# EasyEDA Pro project ProPrj_nrf52833_LighthouseTag_2025-07-26.epro, board PCB18
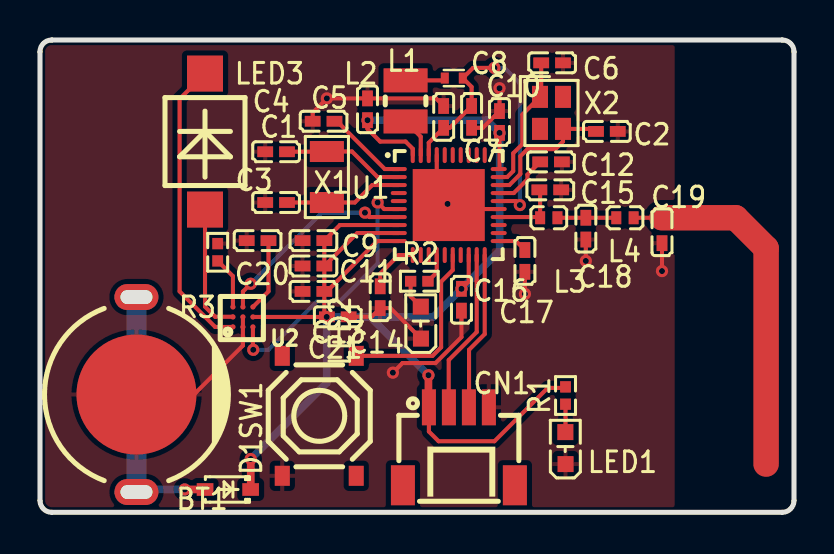
[diagram p5: board, top side]
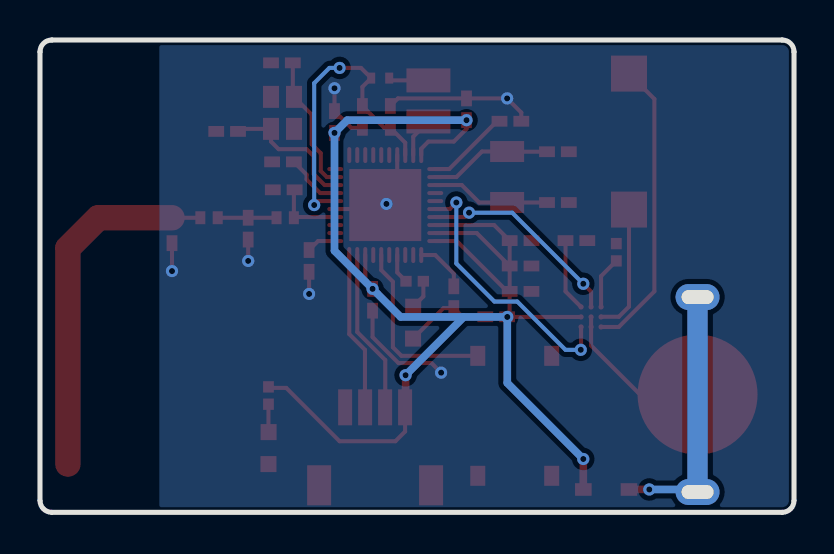
[diagram p6: board, bottom side, seen from below]

Outline 37.72 x 23.62 mm; copper layers: Top Layer, Bottom Layer. Coordinates in mm from the lower left corner of the outline.
Outline path: 0,23.03 0,0.59 arc(0.17,0.17) 0.59,0 37.13,0 arc(37.55,0.17) 37.72,0.59 37.72,23.03 arc(37.55,23.45) 37.13,23.62 0.59,23.62 arc(0.17,23.45) 0,23.03
Stack: Top Layer 0.035mm / Dielectric1 1.51mm FR4 er 4.5 / Bottom Layer 0.035mm

## Design rules (mm)
spacing safeClearance (default): track to track 0.152, other pairs 0.152 to 0.3
track width trackWidth (default): min 0.127, default 0.203, max 2.54
differential pair differentialPair (default): width min 0.127, default 0.254, max 2.54; gap min 0.152, default 0.152
via viaSize (default): diameter min 0.5, default 0.61, max 10; hole min 0.3, default 0.305, max 6

## Placement (name value [footprint] x y rotation side)
BT1  MY-927-01  [BAT-TH_MY-927-01]  4.83 5.89 270 top
C1  12pF  [C0402]  11.81 18.03 0 top
C2  12pF  [C0402]  28.36 19.05 0 top
C3  12pF  [C0402]  11.81 15.49 0 top
C4  100nF  [C0402]  14.19 19.56 180 top
C5  1uF  [C0402]  16.38 20.16 90 top
C6  12pF  [C0402]  25.62 22.48 0 top
C7  47nF  [C0402]  20.19 19.78 90 top
C8  1uF  [C0402]  21.59 19.78 270 top
C9  4.7uF  [C0402]  13.68 13.59 180 top
C10  100nF  [C0402]  22.99 19.52 90 top
C11  4.7uF  [C0402]  13.68 12.32 180 top
C12  100nF  [C0402]  25.56 17.53 0 top
C13  4.7uF  [C0402]  13.68 11.05 180 top
C14  4.7uF  [C0402]  17.02 10.76 90 top
C15  1pF  [C0402]  25.53 16.13 0 top
C16  100nF  [C0402]  21.08 10.63 90 top
C17  820pF  [C0402]  24.26 12.57 270 top
C18  1.2pF  [C0402]  27.31 14.19 90 top
C19  12pF  [C0402]  31.12 14.01 90 top
C20  1uF  [C0402]  10.88 13.59 0 top
C21  100nF  [C0402]  14.9 9.78 0 top
CN1  1.0-4PWB  [CONN-SMD_4P-P1.00_DEALON_1.0-4PWB]  20.96 3.3 0 top
D1  BZT52C3V3S  [SOD-323_L1.7-W1.3-LS2.6-RD]  9.4 1.14 180 top
L1  15nH  [IND-SMD_L1.0-W0.5-2]  20.7 21.72 0 top
L2  10uH  [IND-SMD_L2.5-W2.0]  18.29 20.57 90 top
L3  4.7nH  [IND-SMD_L1.0-W0.6]  25.45 14.73 0 top
L4  2.2nH  [IND-SMD_L1.0-W0.6]  29.26 14.73 0 top
LED1  NCD0603G1  [LED0603-RD_1]  26.29 3.21 90 top
LED2  NCD0603G1  [LED0603-RD_1]  19.05 9.49 90 top
LED3  VBPW34S  [SENSOR-SMD_L4.4-W3.9]  8.25 18.54 90 top
R1  10kΩ  [R0402]  26.29 5.84 90 top
R2  10kΩ  [R0402]  18.97 11.56 0 top
R3  15kΩ  [R0402]  8.89 13.01 270 top
SW1  TS-1187A-B-A-B  [SW-SMD_4P-L5.1-W5.1-P3.70-LS6.5-TL_H1.5]  13.97 4.83 90 top
U1  nRF52833-QDAA-R  [QFN-40_L5.0-W5.0-P0.40-TL-EP3.6]  20.45 15.37 0 top
U2  -  [TS4231]  10.16 9.78 90 top
X1  32.768kHz  [OSC-SMD_L3.2-W1.5]  14.35 16.77 90 top
X2  32MHz  [CRYSTAL-SMD_4P-L2.0-W1.6-BL-2]  25.59 19.98 270 top

## Footprints (pads in the part's own frame, mm; a bottom-side part is the same pattern mirrored in y, then rotated)
BAT-TH_MY-927-01
  oval 1.3x2.2 hole 0.7x1.6: 1(-4.875,-0.001) 1(4.875,0.001)
  round 6 smd: 2(0,0.001)
C0402
  rect 0.79x0.54 smd: 1(-0.545,0) 2(0.545,0)
CONN-SMD_4P-P1.00_DEALON_1.0-4PWB
  rect 0.7x1.8 smd: 1(-1.5,1.95) 2(-0.5,1.95) 3(0.5,1.95) 4(1.5,1.95)
  rect 1.2x2 smd: 5(2.8,-1.95) 6(-2.8,-1.95)
CRYSTAL-SMD_4P-L2.0-W1.6-BL-2
  rect 1.1x0.8 smd: 1(-0.8,-0.575) 2(0.8,-0.575) 3(0.8,0.575) 4(-0.8,0.575)
IND-SMD_L1.0-W0.5-2
  rect 0.4x0.55 smd: 1(-0.45,0) 2(0.45,0)
IND-SMD_L1.0-W0.6
  rect 0.5x0.648 smd: 1(-0.434,0) 2(0.434,0)
IND-SMD_L2.5-W2.0
  rect 1.2x2.2 smd: 1(1.028,0) 2(-1.028,0)
LED0603-RD_1
  rect 0.8x0.8 smd: 1(-0.799,-0.004) 2(0.799,0.004)
OSC-SMD_L3.2-W1.5
  rect 1.05x1.7 smd: 1(-1.275,0) 2(1.275,0)
QFN-40_L5.0-W5.0-P0.40-TL-EP3.6
  oval 0.8x0.2 smd: 1(-2.499,1.8) 2(-2.499,1.4) 3(-2.499,1) 4(-2.499,0.6) 5(-2.499,0.2) 6(-2.499,-0.2) 7(-2.499,-0.6) 8(-2.499,-1) 9(-2.499,-1.4) 10(-2.499,-1.8) 21(2.499,-1.8) 22(2.499,-1.4) 23(2.499,-1) 24(2.499,-0.6) 25(2.499,-0.2) 26(2.499,0.2) 27(2.499,0.6) 28(2.499,1) 29(2.499,1.4) 30(2.499,1.8)
  oval 0.2x0.8 smd: 11(-1.8,-2.499) 12(-1.4,-2.499) 13(-1,-2.499) 14(-0.6,-2.499) 15(-0.2,-2.499) 16(0.2,-2.499) 17(0.6,-2.499) 18(1,-2.499) 19(1.4,-2.499) 20(1.8,-2.499) 31(1.8,2.499) 32(1.4,2.499) 33(1,2.499) 34(0.6,2.499) 35(0.2,2.499) 36(-0.2,2.499) 37(-0.6,2.499) 38(-1,2.499) 39(-1.4,2.499) 40(-1.8,2.499)
  rect 3.6x3.6 smd: 41(0,0)
R0402
  rect 0.566x0.54 smd: 1(-0.433,0) 2(0.433,0)
SENSOR-SMD_L4.4-W3.9
  rect 1.8x1.8 smd: 1(-3.4,0) 2(3.4,0)
SOD-323_L1.7-W1.3-LS2.6-RD
  rect 0.83x0.63 smd: 1(-1.14,0) 2(1.14,0)
SW-SMD_4P-L5.1-W5.1-P3.70-LS6.5-TL_H1.5
  rect 1x0.75 smd: 1(-3,1.85) 2(3,1.85) 3(-3,-1.85) 4(3,-1.85)
TS4231
  round 0.262 smd: 1(-0.508,0.508) 2(-0.008,0.508) 3(0.492,0.508) 4(-0.508,0.008) 5(-0.008,0.008) 6(0.492,0.008) 7(-0.508,-0.492) 8(-0.008,-0.492) 9(0.492,-0.492)

## Nets
GND: BT1.2 C1.1 C2.2 C3.1 C4.2 C5.2 C6.2 C7.2 C8.2 C9.2 C10.2 C11.2 C12.2 C13.2 C14.1 C15.2 C16.1 C17.2 C18.1 C19.1 C20.1 C21.2 CN1.4 LED1.1 LED2.1 R3.1 SW1.1 U1.25 U1.37 U1.41 U2.4 U2.5
VDD_NRF: C5.1 C9.1 C10.1 C11.1 C13.1 C16.2 C21.1 CN1.1 D1.1 R1.2 U1.8 U1.9 U1.10 U1.18 U1.30 U1.40 U2.8
D/CFGDATA: U1.7 U2.6
DCC: L2.2 U1.39
DEC4: C7.1 C8.1 L1.2 U1.26 U1.38
E/CFGCLK: U1.6 U2.7
LED: R2.2 U1.14
RESET: SW1.4 U1.16
SWDCLK: CN1.3 U1.20
SWDIO: CN1.2 U1.19
XC1: C2.1 U1.28 X2.3
XC2: C6.1 U1.29 X2.1
XL1: C1.2 U1.2 X1.2
XL2: C3.2 U1.3 X1.1
$1N1552: C14.2 U1.11
$1N2289: C17.1 U1.21
$1N2530: C15.1 L3.1 U1.24
$1N2985: C18.2 L3.2 L4.1
$1N3242: C19.2 L4.2
$1N3495: C12.1 U1.27
$1N6091: L1.1 L2.1
$1N9430: C20.2 U2.9
$1N11204: LED3.2 U2.1
$1N11226: LED3.1 U2.2
$1N11357: R3.2 U2.3
$1N20837: BT1.1 D1.2
$1N22902: LED2.2 R2.1
$1N23087: C4.1 U1.1
$1N23686: LED1.2 R1.1

Pads without a net: CN1 5 6; SW1 2 3; U1 4 5 12 13 15 17 22 23 31 32 33 34 35 36; X2 2 4

## Via types
v1: diameter 0.61, hole 0.305, Top Layer to Bottom Layer, 20 vias

## Routing (per net, layer and track width the routed paths; a pad name or vN(x,y) marks a point on that pad's centre or on a via; arc(x,y) is an arc through that point)
GND: length 36.9
  Top Layer w0.203: C4.2 13.64,19.99 v1(14.35,20.7) C5.2 19.81,20.7 C7.2 ; U1.25 20.65,15.17 v1(20.39,15.42) 19.85,15.97 U1.37 ; LED2.1 17.53,10.21 C14.1 16.58,9.78 C21.2 ; C19.1 v1(31.12,12.06) ; C18.1 v1(27.31,12.57) ; 4.83,5.97 7.78,5.97 10.15,8.34 U2.4 U2.5 ; 24.26,12.03 v1(24.26,10.92) ; C16.1 21.08,8.76 19.79,7.47 18.14,7.47 v1(17.65,6.98) ; C8.2 22.15,19.23 C10.2 v1(22.99,21.21)
VDD_NRF: length 75.9
  Top Layer w0.203: U1.8 15,14.37 C9.1 C11.1 ; v1(22.99,18.98) 22.99,17.21 U1.30 ; U1.9 15.87,13.97 C11.1 ; C13.1 C11.1 ; C13.1 14.22,9.89 v1(14.34,9.77) ; C13.1 14.35,11.05 16.87,13.57 U1.10 ; U1.40 18.65,18.18 18.29,18.54 17.02,18.54 16.38,19.18 v1(16.38,19.61) ; U2.8 v1(14.34,9.77) ; v1(14.34,9.77) C21.1 ; v1(21.08,11.18) 21.45,11.54 U1.18 ; 26.24,6.22 25.4,6.22 22.73,3.56 19.94,3.56 19.46,4.04 19.46,5
  Top Layer w0.381: 19.46,5 19.43,5.02 v1(19.43,6.86) ; v1(10.54,2.67) 10.54,1.15 10.54,1.14
  Bottom Layer w0.381: v1(16.38,19.61) 22.35,19.61 v1(22.99,18.98) 22.99,13.08 v1(21.08,11.18) 19.68,9.77 16.52,9.77 ; v1(19.43,6.86) 16.52,9.77 ; 16.52,9.77 v1(14.34,9.77) 14.34,6.47 v1(10.54,2.67)
D/CFGDATA: length 10.3
  Top Layer w0.203: v1(10.54,11.43) 10.15,11.04 U2.6 ; U1.7 16.47,14.77 v1(16.26,14.99)
  Bottom Layer w0.203: v1(10.54,11.43) 14.1,14.99 v1(16.26,14.99)
DCC: length 2
  Top Layer w0.203: L2.2 19.05,18.79 U1.39
DEC4: length 15.7
  Top Layer w0.203: U1.26 23.8,15.57 v1(24,15.37) ; v1(22.73,22.22) 21.66,22.22 L1.2 21.59,21.28 C8.1 20.5,19.23 C7.1 19.45,18.48 U1.38
  Bottom Layer w0.203: v1(24,15.37) 24,21.46 23.24,22.22 v1(22.73,22.22)
E/CFGCLK: length 13.4
  Top Layer w0.203: v1(16.89,15.49) 17.22,15.17 U1.6 ; U2.7 10.65,8.14 v1(10.67,8.13)
  Bottom Layer w0.203: v1(16.89,15.49) 16.89,12.45 14.99,10.54 13.84,10.54 11.43,8.13 v1(10.67,8.13)
LED: length 1.5
  Top Layer w0.203: U1.14 19.85,12 R2.2
RESET: length 9.3
  Top Layer w0.203: U1.16 20.65,12.11 20.07,11.53 20.07,8.25 19.64,7.83 SW1.4
SWDCLK: length 8.1
  Top Layer w0.203: U1.20 22.25,8.91 21.46,8.13 21.46,5.05
SWDIO: length 8.4
  Top Layer w0.203: 21.85,11.56 21.84,11.56 ; 21.85,11.56 21.85,9.02 20.45,7.61 20.45,5.08 ; 21.85,11.56 U1.19
XC1: length 7
  Top Layer w0.203: C2.1 27.69,19.18 26.16,19.18 26.16,18.54 25.78,18.16 24.38,18.16 24.03,17.81 24.03,16.92 23.48,16.37 U1.28
XC2: length 6.8
  Top Layer w0.203: C6.1 25.07,20.84 X2.1 24.13,19.89 24.13,18.42 23.67,17.96 23.67,17.07 23.37,16.77 U1.29
XL1: length 6.1
  Top Layer w0.203: C1.2 14.34,18.03 X1.2 15.61,18.04 16.89,16.77 U1.2
XL2: length 6
  Top Layer w0.203: C3.2 X1.1 15.75,15.49 16.62,16.37 U1.3
$1N1552: length 2.6
  Top Layer w0.203: C14.2 17.02,11.94 17.95,12.87 U1.11
$1N2289: length 1.5
  Top Layer w0.203: C17.1 23.81,13.57 U1.21
$1N2530: length 3.5
  Top Layer w0.203: C15.1 25.02,16.09 L3.1 24.98,14.77 U1.24
$1N2985: length 2.9
  Top Layer w0.203: L4.1 C18.2 L3.2
$1N3242: length 18.1
  Top Layer w0.203: L4.2 31.12,14.73
  Top Layer w1.27: 31.12,14.73 34.8,14.73 36.32,13.21 36.32,2.41
$1N3495: length 2.9
  Top Layer w0.203: C12.1 24.38,16.89 24.38,16.65 23.7,15.97 U1.27
$1N6091: length 2
  Top Layer w0.203: L1.1 20.14,21.6 L2.1
$1N9430: length 3.6
  Top Layer w0.203: 11.43,13.59 11.43,11.05 U2.9
$1N11204: length 14.8
  Top Layer w0.203: U2.1 8.76,9.27 6.99,11.05 6.99,20.67 8.25,21.94
$1N11226: length 6.5
  Top Layer w0.203: U2.2 9.64,9.78 8.76,9.78 8.25,10.29 LED3.1
$1N11357: length 2.6
  Top Layer w0.203: U2.3 9.65,11.81 R3.2
$1N20837: length 13.1
  Top Layer w0.381: v1(7.24,1.14) D1.2
  Bottom Layer w0.381: v1(7.24,1.14) 4.88,1.14 4.83,1.09
  Bottom Layer w1.016: 4.83,1.09 4.83,10.72
$1N22902: length 1.5
  Top Layer w0.203: LED2.2 18.54,10.8 R2.1
$1N23087: length 4.2
  Top Layer w0.203: C4.1 14.86,19.56 17.25,17.17 U1.1
$1N23686: length 1.4
  Top Layer w0.203: R1.1 26.29,4.02 LED1.2

## Copper pours and planes (outline as drawn; the poured copper is in the pictures)
GND on Top Layer: -1.78,24.89 40.13,24.89 40.13,-3.17 -1.78,-3.17
GND on Bottom Layer: -1.14,25.53 39.24,25.53 39.24,-2.29 -1.14,-2.29
